# Altium schematic sheet Schematic.SchDoc (part 3 of 3)
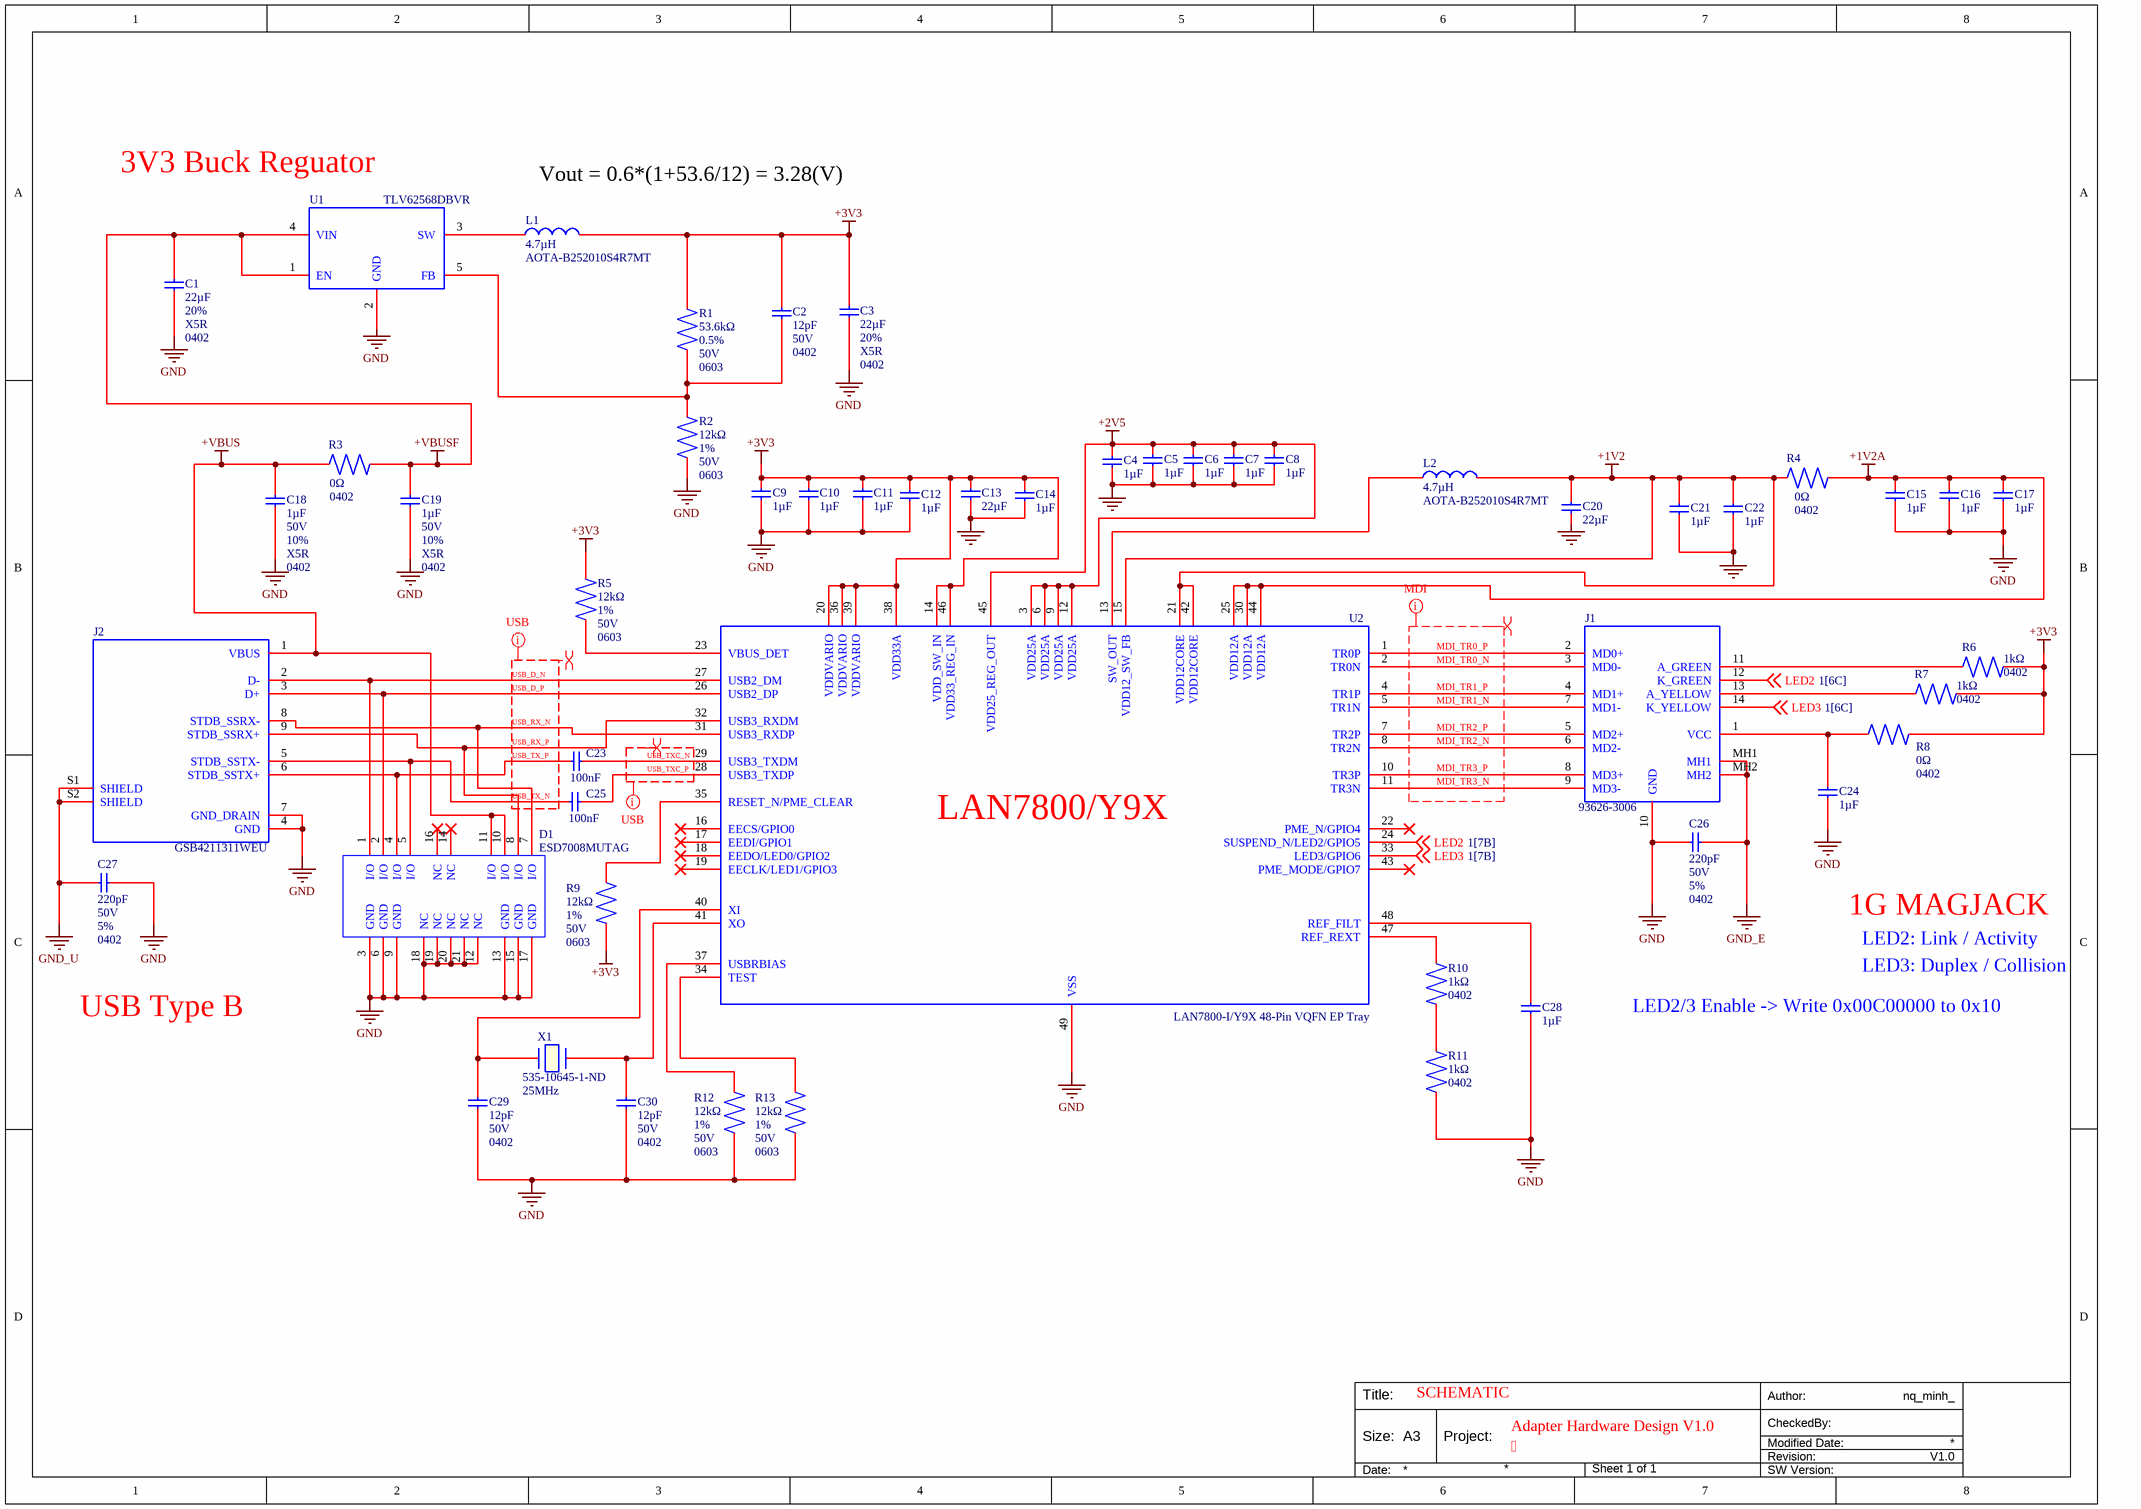
[diagram p2: Schematic.SchDoc]

## Library data of the parts (continued)
R3 R4 R8 = RC0402JR-070RL: GENERAL PURPOSE CHIP RESISTOR Metal Glaze/thick Film, 0.0625W, 0ohm, Surface Mount, 0402; Manufacturer: Yageo Group; Max Power Dissipation: 63mW; Power Rating: 62.5mW; Temperature Coefficient: 200ppm/°C; Voltage Rating (DC): 50V; Tolerance: 5%; Supplier: DigiKey; Supplier Part Number: 311-0.0JRDKR-ND; Manufacturer Part Number: RC0402JR-070RL; RoHS: Compliant; Category: Chip SMD Resistors; Stock: 16568824; Pricing: 1=0,1, 10=0,010, 25=0,0064, 50=0,0056, 100=0,0048, 250=0,00404, 500=0,00356, 1000=0,00313, 5000=0,00237 (USD); Case Code (Imperial): 0402; China RoHS: Non-Compliant; Composition: Thick Film; Contact Plating: Tin; Depth: 500µm; Features: Moisture Resistant; Height: 350µm; Lead Free: Lead Free; Length: 1mm; Lifecycle Status: Production; Max Operating Temperature: 155°C; Military Standard: Not; Min Operating Temperature: -55°C; Mounting Technology: Surface Mount; Pins: 2; Number of Terminals: 2; Number of Terminations: 2; Packaging: Tape & Reel; Radiation Hardening: No; REACH SVHC: Yes; Value: 0Ω; Schedule B: 8533290000, 8533290000|8533290000, 8533290000|8533290000|8533290000, 8533290000|8533290000|8533290000|8533290000; Termination: SMD/SMT; Width: 500µm; ComponentLink1URL: https://datasheet.octopart.com:443/RC0402JR-070RL-Yageo-datasheet-182189538.pdf?src-supplier=IHS; ComponentLink1Description: https://datasheet.octopart.com:443/RC0402JR-070RL-Yageo-datasheet-182189538.pdf?src-supplier=IHS; ComponentLink2URL: https://datasheet.octopart.com:443/RC0402JR-070RL-Yageo-datasheet-10408619.pdf?src-supplier=Newark; ComponentLink2Description: https://datasheet.octopart.com:443/RC0402JR-070RL-Yageo-datasheet-10408619.pdf?src-supplier=Newark; ComponentLink3URL: https://datasheet.octopart.com:443/RC0402JR-070RL-Yageo-Group-datasheet-181964826.pdf?src-supplier=Newark; ComponentLink3Description: https://datasheet.octopart.com:443/RC0402JR-070RL-Yageo-Group-datasheet-181964826.pdf?src-supplier=Newark; ComponentLink4URL: https://datasheet.octopart.com:443/RC0402JR-070RL-Yageo-Group-datasheet-190305687.pdf?src-supplier=Future+Electronics; ComponentLink4Description: https://datasheet.octopart.com:443/RC0402JR-070RL-Yageo-Group-datasheet-190305687.pdf?src-supplier=Future+Electronics; ComponentLink5URL: https://datasheet.octopart.com:443/RC0402JR-070RL-Yageo-datasheet-164759695.pdf?src-supplier=Future+Electronics; ComponentLink5Description: https://datasheet.octopart.com:443/RC0402JR-070RL-Yageo-datasheet-164759695.pdf?src-supplier=Future+Electronics; ComponentLink6URL: https://datasheet.octopart.com:443/RC0402JR-070RL-Yageo-datasheet-137700087.pdf?src-supplier=Future+Electronics; ComponentLink6Description: https://datasheet.octopart.com:443/RC0402JR-070RL-Yageo-datasheet-137700087.pdf?src-supplier=Future+Electronics; ComponentLink7URL: https://datasheet.octopart.com:443/RC0402JR-070RL-Yageo-datasheet-12531192.pdf?src-supplier=Seeed+Studio; ComponentLink7Description: https://datasheet.octopart.com:443/RC0402JR-070RL-Yageo-datasheet-12531192.pdf?src-supplier=Seeed+Studio; ComponentLink8URL: https://datasheet.octopart.com:443/RC0402JR-070RL-Yageo-datasheet-8324527.pdf?src-supplier=TME; ComponentLink8Description: https://datasheet.octopart.com:443/RC0402JR-070RL-Yageo-datasheet-8324527.pdf?src-supplier=TME; ComponentLink9URL: https://datasheet.octopart.com:443/RC0402JR-070RL-Yageo-datasheet-62067350.pdf?src-supplier=Farnell; ComponentLink9Description: https://datasheet.octopart.com:443/RC0402JR-070RL-Yageo-datasheet-62067350.pdf?src-supplier=Farnell; ComponentLink10URL: https://datasheet.octopart.com:443/RC0402JR-070RL-Yageo-datasheet-8329306.pdf?src-supplier=element14; ComponentLink10Description: https://datasheet.octopart.com:443/RC0402JR-070RL-Yageo-datasheet-8329306.pdf?src-supplier=element14; ComponentLink11URL: https://datasheet.octopart.com:443/RC0402JR-070RL-Yageo-datasheet-505231.pdf?src-supplier=element14; ComponentLink11Description: https://datasheet.octopart.com:443/RC0402JR-070RL-Yageo-datasheet-505231.pdf?src-supplier=element14; ComponentLink12URL: https://datasheet.octopart.com:443/RC0402JR-070RL-Yageo-datasheet-175423674.pdf?src-supplier=SOS+electronic; ComponentLink12Description: https://datasheet.octopart.com:443/RC0402JR-070RL-Yageo-datasheet-175423674.pdf?src-supplier=SOS+electronic; ComponentLink13URL: https://datasheet.octopart.com/RC0402JR-070RL-Yageo-datasheet-73766026.pdf; ComponentLink13Description: https://datasheet.octopart.com/RC0402JR-070RL-Yageo-datasheet-73766026.pdf; ComponentLink14URL: http://sigma.octopart.com:80/conflict_mineral_statement/Yageo-company-3.pdf?src-supplier=Compliance+Statements; ComponentLink14Description: http://sigma.octopart.com:80/conflict_mineral_statement/Yageo-company-3.pdf?src-supplier=Compliance+Statements; ComponentLink15URL: http://sigma.octopart.com:80/rohs_statement/Yageo-company-2.pdf?src-supplier=Compliance+Statements; ComponentLink15Description: http://sigma.octopart.com:80/rohs_statement/Yageo-company-2.pdf?src-supplier=Compliance+Statements; LCSC Part: C60485; Voltage Rating: 50V
R6 R7 R10 R11 = R0402_1kΩ_0.1%: RES SMD 1K OHM 0.1% 1/16W 0402 / 1 kOhms ±0.1% 0.063W, 1/16W Chip Resistor 0402 (1005 Metric) Thin Film; Manufacturer: Yageo Group; Manufacturer Part Number: RT0402BRD071KL; Max Power Dissipation: 63mW; Power Rating: 62.5mW; Temperature Coefficient: 25ppm/°C; Voltage Rating (DC): 50V; Supplier: DigiKey; Supplier Part Number: YAG1386CT-ND; RoHS: Compliant; Category: Chip SMD Resistors; Stock: 101139; Pricing: 1=0,1, 10=0,078, 25=0,0724, 50=0,0684, 100=0,0646, 250=0,05992, 500=0,05672, 1000=0,05377, 5000=0,04796 (USD); Case Code (Imperial): 0402; China RoHS: Non-Compliant; Composition: Thin Film; Depth: 500µm; Features: Moisture Resistant; Height: 300µm; Lead Free: Lead Free; Length: 1mm; Lifecycle Status: Production; Max Operating Temperature: 155°C; Military Standard: Not; Min Operating Temperature: -55°C; Mounting Technology: Surface Mount; Number of Terminals: 2; Number of Terminations: 2; REACH SVHC: Yes; Value: 1kΩ; Schedule B: 8533210045, 8533210045|8533210045|8533210045|8533210045|8533210045|8533210045|8533210045|8533210045|8533210045|8533210045|8533210045|8533210045|8533210045, 8533210045|8533210045|8533210045|8533210045|8533210045|8533210045|8533210045|8533210045|8533210045|8533210045|8533210045|8533210045|8533210045|8533210045, 8533210045|8533210045|8533210045|8533210045|8533210045|8533210045|8533210045|8533210045|8533210045|8533210045|8533210045|8533210045|8533210045|8533210045|8533210045; Termination: SMD/SMT; Weight: 652.039032µg; Width: 500µm; Working Voltage: 50V; ComponentLink1URL: https://datasheet.octopart.com:443/RT0402BRD071KL-Yageo-datasheet-176402239.pdf?src-supplier=Future+Electronics; ComponentLink1Description: https://datasheet.octopart.com:443/RT0402BRD071KL-Yageo-datasheet-176402239.pdf?src-supplier=Future+Electronics; ComponentLink2URL: https://datasheet.octopart.com:443/RT0402BRD071KL-Yageo-datasheet-169971040.pdf?src-supplier=Future+Electronics; ComponentLink2Description: https://datasheet.octopart.com:443/RT0402BRD071KL-Yageo-datasheet-169971040.pdf?src-supplier=Future+Electronics; ComponentLink3URL: https://datasheet.octopart.com:443/RT0402BRD071KL-Yageo-datasheet-166250672.pdf?src-supplier=Future+Electronics; ComponentLink3Description: https://datasheet.octopart.com:443/RT0402BRD071KL-Yageo-datasheet-166250672.pdf?src-supplier=Future+Electronics; ComponentLink4URL: https://datasheet.octopart.com:443/RT0402BRD071KL-Yageo-datasheet-136673517.pdf?src-supplier=Future+Electronics; ComponentLink4Description: https://datasheet.octopart.com:443/RT0402BRD071KL-Yageo-datasheet-136673517.pdf?src-supplier=Future+Electronics; ComponentLink5URL: https://datasheet.octopart.com:443/RT0402BRD071KL-Yageo-datasheet-137700930.pdf?src-supplier=Future+Electronics; ComponentLink5Description: https://datasheet.octopart.com:443/RT0402BRD071KL-Yageo-datasheet-137700930.pdf?src-supplier=Future+Electronics; ComponentLink6URL: https://datasheet.octopart.com:443/RT0402BRD071KL-Yageo-datasheet-96443642.pdf?src-supplier=Future+Electronics; ComponentLink6Description: https://datasheet.octopart.com:443/RT0402BRD071KL-Yageo-datasheet-96443642.pdf?src-supplier=Future+Electronics; ComponentLink7URL: https://datasheet.octopart.com:443/RT0402BRD071KL-Yageo-datasheet-12594463.pdf?src-supplier=Future+Electronics; ComponentLink7Description: https://datasheet.octopart.com:443/RT0402BRD071KL-Yageo-datasheet-12594463.pdf?src-supplier=Future+Electronics; ComponentLink8URL: https://datasheet.octopart.com:443/RT0402BRD071KL-Yageo-datasheet-8324589.pdf?src-supplier=Future+Electronics; ComponentLink8Description: https://datasheet.octopart.com:443/RT0402BRD071KL-Yageo-datasheet-8324589.pdf?src-supplier=Future+Electronics; ComponentLink9URL: https://datasheet.octopart.com:443/RT0402BRD071KL-Yageo-datasheet-34924148.pdf?src-supplier=Future+Electronics; ComponentLink9Description: https://datasheet.octopart.com:443/RT0402BRD071KL-Yageo-datasheet-34924148.pdf?src-supplier=Future+Electronics; ComponentLink10URL: https://datasheet.octopart.com:443/RT0402BRD071KL-Yageo-datasheet-141265893.pdf?src-supplier=ODG+(Origin+Data+Global); ComponentLink10Description: https://datasheet.octopart.com:443/RT0402BRD071KL-Yageo-datasheet-141265893.pdf?src-supplier=ODG+(Origin+Data+Global); ComponentLink11URL: https://sigma.octopart.com:443/138820526/technical_drawing/Yageo-RT0402BRD071KL.pdf?src-supplier=Upverter; ComponentLink11Description: https://sigma.octopart.com:443/138820526/technical_drawing/Yageo-RT0402BRD071KL.pdf?src-supplier=Upverter; ComponentLink12URL: https://datasheet.octopart.com:443/RT0402BRD071KL-Yageo-datasheet-10915759.pdf?src-supplier=TME; ComponentLink12Description: https://datasheet.octopart.com:443/RT0402BRD071KL-Yageo-datasheet-10915759.pdf?src-supplier=TME; ComponentLink13URL: https://datasheet.octopart.com:443/RT0402BRD071KL-Yageo-datasheet-164439670.pdf?src-supplier=Newark; ComponentLink13Description: https://datasheet.octopart.com:443/RT0402BRD071KL-Yageo-datasheet-164439670.pdf?src-supplier=Newark; ComponentLink14URL: https://datasheet.octopart.com:443/RT0402BRD071KL-Yageo-datasheet-120102479.pdf?src-supplier=Megastar; ComponentLink14Description: https://datasheet.octopart.com:443/RT0402BRD071KL-Yageo-datasheet-120102479.pdf?src-supplier=Megastar; ComponentLink15URL: https://datasheet.octopart.com/RT0402BRD071KL-Yageo-datasheet-86813807.pdf; ComponentLink15Description: https://datasheet.octopart.com/RT0402BRD071KL-Yageo-datasheet-86813807.pdf; ComponentLink16URL: http://sigma.octopart.com:80/conflict_mineral_statement/Yageo-company-3.pdf?src-supplier=Compliance+Statements; ComponentLink16Description: http://sigma.octopart.com:80/conflict_mineral_statement/Yageo-company-3.pdf?src-supplier=Compliance+Statements; ComponentLink17URL: http://sigma.octopart.com:80/rohs_statement/Yageo-company-2.pdf?src-supplier=Compliance+Statements; ComponentLink17Description: http://sigma.octopart.com:80/rohs_statement/Yageo-company-2.pdf?src-supplier=Compliance+Statements; LCSC Part: C852624; Tolerance: 0.1%; Voltage Rating: 50V
U1 = TLV62568DBVR: ROHS3Compliant Adjustable Positive DUAL Switching Regulator IC -40C~125C TJ 1.5MHz 1A 1.6mm; Manufacturer: Texas Instruments; Manufacturer Lifecycle Status: ACTIVE; Max Duty Cycle: 100%; Max Junction Temperature (Tj): 125°C; Max Supply Voltage: 5.5V; Min Supply Voltage: 2.5V; Nominal Supply Current: 35µA; Number of Channels: 1; Topology: Buck; Supplier: DigiKey; Supplier Part Number: 296-47359-1-ND; Manufacturer Part Number: TLV62568DBVR; RoHS: Compliant; Category: Voltage Regulators - Switching; Stock: 47066; Pricing: 1=0,32, 10=0,222, 25=0,1972, 100=0,1697, 250=0,1566, 500=0,14868, 1000=0,14216 (USD); Case/Package: SOT-23; Height: 1.45mm; Length: 2.9mm; Lifecycle Status: Production; Max Operating Temperature: 125°C; Min Operating Temperature: -40°C; Number of Outputs: 1; Pins: 5; Output Current: 1A; Output Voltage: 5.5V; Packaging: Cut Tape; Schedule B: 8542390000, 8542390000|8542390000|8542390000|8542390000|8542390000; Switching Frequency: 1.5MHz; Thickness: 1.2mm; Width: 1.6mm; ComponentLink1URL: https://sigma.octopart.com:443/177332311/technical_drawing/Texas-Instruments-TLV62568DBVR.pdf?src-supplier=Texas+Instruments; ComponentLink1Description: https://sigma.octopart.com:443/177332311/technical_drawing/Texas-Instruments-TLV62568DBVR.pdf?src-supplier=Texas+Instruments; ComponentLink2URL: https://octopart.com:443/opatz8j6/c1?t=vPHbBTZync03nc36PRH4evl9f9XS3pRQdSmbiysQsMfDLG0HXrdI_A5Kjl8OaFtSQD0YLbQeJgMP-_JQaVrb-4MwD9lWSaxscQNQWteh7Ox_BwG2tlOEVzeoiAwU9PQpDczjkd1NvrO29_tBD_-kASWfwXWMSSZbSn8J3ugEkJYM36bt8V1c5ce8ivLbuwT9JHlDmiS_2qQgvZdWgloT7CjqD7HxfNGaoxnW2-1KbVj-rghSNpHCP-x5DM5iAr4G7eP6joer0wBZ-Um1XcgZjkJuH9ew8i6R7p-JMymC5vPEZUbQvtDFT-Y1ZDIuA0Iyj9w-1LHecovXeRxQwQ6BdQFRy4KrXcWI-2UEDx3VIn_4HQ_sDR11ymwJEK4-_c0cmN6tyAYi&src-supplier=Texas+Instruments; ComponentLink2Description: https://octopart.com:443/opatz8j6/c1?t=vPHbBTZync03nc36PRH4evl9f9XS3pRQdSmbiysQsMfDLG0HXrdI_A5Kjl8OaFtSQD0YLbQeJgMP-_JQaVrb-4MwD9lWSaxscQNQWteh7Ox_BwG2tlOEVzeoiAwU9PQpDczjkd1NvrO29_tBD_-kASWfwXWMSSZbSn8J3ugEkJYM36bt8V1c5ce8ivLbuwT9JHlDmiS_2qQgvZdWgloT7CjqD7HxfNGaoxnW2-1KbVj-rghSNpHCP-x5DM5iAr4G7eP6joer0wBZ-Um1XcgZjkJuH9ew8i6R7p-JMymC5vPEZUbQvtDFT-Y1ZDIuA0Iyj9w-1LHecovXeRxQwQ6BdQFRy4KrXcWI-2UEDx3VIn_4HQ_sDR11ymwJEK4-_c0cmN6tyAYi&src-supplier=Texas+Instruments; ComponentLink3URL: https://sigma.octopart.com:443/175570406/technical_drawing/Texas-Instruments-TLV62568DBVR.pdf?src-supplier=Texas+Instruments; ComponentLink3Description: https://sigma.octopart.com:443/175570406/technical_drawing/Texas-Instruments-TLV62568DBVR.pdf?src-supplier=Texas+Instruments; ComponentLink4URL: https://sigma.octopart.com:443/169406034/technical_drawing/Texas-Instruments-TLV62568DBVR.pdf?src-supplier=Texas+Instruments; ComponentLink4Description: https://sigma.octopart.com:443/169406034/technical_drawing/Texas-Instruments-TLV62568DBVR.pdf?src-supplier=Texas+Instruments; ComponentLink5URL: https://sigma.octopart.com:443/155939316/technical_drawing/Texas-Instruments-TLV62568DBVR.pdf?src-supplier=Texas+Instruments; ComponentLink5Description: https://sigma.octopart.com:443/155939316/technical_drawing/Texas-Instruments-TLV62568DBVR.pdf?src-supplier=Texas+Instruments; ComponentLink6URL: https://sigma.octopart.com:443/102331370/technical_drawing/Texas-Instruments-TLV62568DBVR.pdf?src-supplier=Texas+Instruments; ComponentLink6Description: https://sigma.octopart.com:443/102331370/technical_drawing/Texas-Instruments-TLV62568DBVR.pdf?src-supplier=Texas+Instruments; ComponentLink7URL: https://sigma.octopart.com:443/49249325/technical_drawing/Texas-Instruments-TLV62568DBVR.pdf?src-supplier=Texas+Instruments; ComponentLink7Description: https://sigma.octopart.com:443/49249325/technical_drawing/Texas-Instruments-TLV62568DBVR.pdf?src-supplier=Texas+Instruments; ComponentLink8URL: https://datasheet.octopart.com:443/TLV62568DBVR-Texas-Instruments-datasheet-82523182.pdf?src-supplier=Newark; ComponentLink8Description: https://datasheet.octopart.com:443/TLV62568DBVR-Texas-Instruments-datasheet-82523182.pdf?src-supplier=Newark; ComponentLink9URL: https://datasheet.octopart.com:443/TLV62568DBVR-Texas-Instruments-datasheet-137316104.pdf?src-supplier=Future+Electronics; ComponentLink9Description: https://datasheet.octopart.com:443/TLV62568DBVR-Texas-Instruments-datasheet-137316104.pdf?src-supplier=Future+Electronics; ComponentLink10URL: http://sigma.octopart.com:80/reach_statement/Texas-Instruments-company-64.pdf?src-supplier=Compliance+Statements; ComponentLink10Description: http://sigma.octopart.com:80/reach_statement/Texas-Instruments-company-64.pdf?src-supplier=Compliance+Statements; ComponentLink11URL: http://sigma.octopart.com:80/conflict_mineral_statement/Texas-Instruments-company-63.pdf?src-supplier=Compliance+Statements; ComponentLink11Description: http://sigma.octopart.com:80/conflict_mineral_statement/Texas-Instruments-company-63.pdf?src-supplier=Compliance+Statements; LCSC Part: C163219
U2 = LAN7800-I/Y9X: Ethernet CTLR Single Chip 10Mbps/100Mbps/1000Mbps 1.8V/3.3V Automotive 48-Pin VQFN EP Tray; Manufacturer: Microchip; Manufacturer Lifecycle Status: REL; Interface: Ethernet, USB; Max Supply Voltage: 3.63V; Min Supply Voltage: 1.62V; Supplier: DigiKey; Supplier Part Number: LAN7800-I/Y9X-ND; Manufacturer Part Number: LAN7800-I/Y9X; RoHS: Compliant; Category: Ethernet Controller; Stock: 4393; Pricing: 1=10,87, 25=9,04, 100=8,7375 (USD); Projected EOL Date: 2044-10-28; Ambient Temperature Range High: 85°C; Case/Package: VQFN; Country of Assembly: Taiwan, Thailand; Country of Fabrication: Taiwan; Country of Origin: Taiwan, Thailand; Export Control Classification Number (ECCN) Code: EAR99; Height: 1mm; HS Code: 8542.39.0090; Harmonized Tariff Schedule (HTS) Code: 8542.39.0060; Introduction Date: 2016-10-28; Lifecycle Status: Production; Max Operating Temperature: 85°C; Min Operating Temperature: -40°C; Pins: 48; ComponentLink1URL: https://datasheet.octopart.com:443/LAN7800-I-Y9X-Microchip-datasheet-145017544.pdf?src-supplier=Augswan; ComponentLink1Description: https://datasheet.octopart.com:443/LAN7800-I-Y9X-Microchip-datasheet-145017544.pdf?src-supplier=Augswan; ComponentLink2URL: https://datasheet.octopart.com:443/LAN7800-I-Y9X-Microchip-datasheet-184559086.pdf?src-supplier=Microchip; ComponentLink2Description: https://datasheet.octopart.com:443/LAN7800-I-Y9X-Microchip-datasheet-184559086.pdf?src-supplier=Microchip; ComponentLink3URL: https://datasheet.octopart.com:443/LAN7800-I-Y9X-Microchip-datasheet-175858607.pdf?src-supplier=Microchip; ComponentLink3Description: https://datasheet.octopart.com:443/LAN7800-I-Y9X-Microchip-datasheet-175858607.pdf?src-supplier=Microchip; ComponentLink4URL: https://datasheet.octopart.com:443/LAN7800-I-Y9X-Microchip-datasheet-102166462.pdf?src-supplier=Newark; ComponentLink4Description: https://datasheet.octopart.com:443/LAN7800-I-Y9X-Microchip-datasheet-102166462.pdf?src-supplier=Newark; ComponentLink5URL: https://datasheet.octopart.com:443/LAN7800-I-Y9X-Microchip-datasheet-78799795.pdf?src-supplier=TME; ComponentLink5Description: https://datasheet.octopart.com:443/LAN7800-I-Y9X-Microchip-datasheet-78799795.pdf?src-supplier=TME; ComponentLink6URL: http://sigma.octopart.com:80/188454375/materials_sheet/Microchip-LAN7800-I-Y9X.pdf?src-supplier=Compliance+Statements; ComponentLink6Description: http://sigma.octopart.com:80/188454375/materials_sheet/Microchip-LAN7800-I-Y9X.pdf?src-supplier=Compliance+Statements; ComponentLink7URL: http://sigma.octopart.com:80/rohs_statement/Microchip-company-71.pdf?src-supplier=Compliance+Statements; ComponentLink7Description: http://sigma.octopart.com:80/rohs_statement/Microchip-company-71.pdf?src-supplier=Compliance+Statements; ComponentLink8URL: http://sigma.octopart.com:80/reach_statement/Microchip-company-70.pdf?src-supplier=Compliance+Statements; ComponentLink8Description: http://sigma.octopart.com:80/reach_statement/Microchip-company-70.pdf?src-supplier=Compliance+Statements; ComponentLink9URL: http://sigma.octopart.com:80/conflict_mineral_statement/Microchip-company-69.pdf?src-supplier=Compliance+Statements; ComponentLink9Description: http://sigma.octopart.com:80/conflict_mineral_statement/Microchip-company-69.pdf?src-supplier=Compliance+Statements; ComponentLink10URL: http://sigma.octopart.com:80/conflict_mineral_statement/Microchip-company-68.pdf?src-supplier=Compliance+Statements; ComponentLink10Description: http://sigma.octopart.com:80/conflict_mineral_statement/Microchip-company-68.pdf?src-supplier=Compliance+Statements; LCSC Part: C633489
X1 = ABM3-25.000MHZ-D2Y-T: Crystal 25MHz ±20ppm (Tol) ±30ppm (Stability) 18pF FUND 30Ohm 2-Pin Mini-CSMD T/R; Manufacturer: Abracon; ESR (Equivalent Series Resistance): 30Ω; Frequency Tolerance: 0.002%; ESR: 50Ω; Supplier: DigiKey; Manufacturer Part Number: ABM3-25.000MHZ-D2Y-T; RoHS: Compliant; Category: Crystals; Stock: 14698; Pricing: 1=0,55, 10=0,481, 25=0,4552, 50=0,4364, 100=0,4183, 250=0,39556, 500=0,37918 (USD); Case/Package: CSMD; China RoHS: Non-Compliant; Composition: Ceramic; Depth: 3.2mm; Frequency Stability: 30ppm; Height: 1.3mm; Lead Free: Lead Free; Length: 5mm; Lifecycle Status: Production; Load Capacitance: 18pF; Max Operating Temperature: 85°C; Min Operating Temperature: -40°C; Mounting Technology: Surface Mount; Pins: 2; Packaging: Cut Tape; REACH SVHC: Yes; Schedule B: 8541600060, 8541600060|8541600060|8541600060|8541600060|8541600060; Termination: SMD/SMT; Tolerance: 0.002%; Width: 3.2mm; ComponentLink1URL: https://datasheet.octopart.com:443/ABM3-25.000MHZ-D2Y-T-Abracon-datasheet-182205007.pdf?src-supplier=JRH+Electronics; ComponentLink1Description: https://datasheet.octopart.com:443/ABM3-25.000MHZ-D2Y-T-Abracon-datasheet-182205007.pdf?src-supplier=JRH+Electronics; ComponentLink2URL: https://datasheet.octopart.com:443/ABM3-25.000MHZ-D2Y-T-Abracon-datasheet-32780515.pdf?src-supplier=element14+APAC; ComponentLink2Description: https://datasheet.octopart.com:443/ABM3-25.000MHZ-D2Y-T-Abracon-datasheet-32780515.pdf?src-supplier=element14+APAC; ComponentLink3URL: https://sigma.octopart.com:443/138895675/technical_drawing/Abracon-ABM3-25.000MHZ-D2Y-T.pdf?src-supplier=Upverter; ComponentLink3Description: https://sigma.octopart.com:443/138895675/technical_drawing/Abracon-ABM3-25.000MHZ-D2Y-T.pdf?src-supplier=Upverter; ComponentLink4URL: https://datasheet.octopart.com:443/ABM3-25.000MHZ-D2Y-T-Abracon-datasheet-13417521.pdf?src-supplier=Sager+Electronics; ComponentLink4Description: https://datasheet.octopart.com:443/ABM3-25.000MHZ-D2Y-T-Abracon-datasheet-13417521.pdf?src-supplier=Sager+Electronics; ComponentLink5URL: https://datasheet.octopart.com:443/ABM3-25.000MHZ-D2Y-T-Abracon-datasheet-8862594.pdf?src-supplier=Sager+Electronics; ComponentLink5Description: https://datasheet.octopart.com:443/ABM3-25.000MHZ-D2Y-T-Abracon-datasheet-8862594.pdf?src-supplier=Sager+Electronics; ComponentLink6URL: https://datasheet.octopart.com:443/ABM3-25.000MHZ-D2Y-T-Abracon-datasheet-8853172.pdf?src-supplier=Sager+Electronics; ComponentLink6Description: https://datasheet.octopart.com:443/ABM3-25.000MHZ-D2Y-T-Abracon-datasheet-8853172.pdf?src-supplier=Sager+Electronics; ComponentLink7URL: https://datasheet.octopart.com:443/ABM3-25.000MHZ-D2Y-T-Abracon-datasheet-8835795.pdf?src-supplier=Sager+Electronics; ComponentLink7Description: https://datasheet.octopart.com:443/ABM3-25.000MHZ-D2Y-T-Abracon-datasheet-8835795.pdf?src-supplier=Sager+Electronics; ComponentLink8URL: https://datasheet.octopart.com:443/ABM3-25.000MHZ-D2Y-T-Abracon-datasheet-8815637.pdf?src-supplier=Sager+Electronics; ComponentLink8Description: https://datasheet.octopart.com:443/ABM3-25.000MHZ-D2Y-T-Abracon-datasheet-8815637.pdf?src-supplier=Sager+Electronics; ComponentLink9URL: https://datasheet.octopart.com:443/ABM3-25.000MHZ-D2Y-T-Abracon-datasheet-8808528.pdf?src-supplier=Sager+Electronics; ComponentLink9Description: https://datasheet.octopart.com:443/ABM3-25.000MHZ-D2Y-T-Abracon-datasheet-8808528.pdf?src-supplier=Sager+Electronics; ComponentLink10URL: https://datasheet.octopart.com:443/ABM3-25.000MHZ-D2Y-T-Abracon-datasheet-8488864.pdf?src-supplier=Sager+Electronics; ComponentLink10Description: https://datasheet.octopart.com:443/ABM3-25.000MHZ-D2Y-T-Abracon-datasheet-8488864.pdf?src-supplier=Sager+Electronics; ComponentLink11URL: https://datasheet.octopart.com:443/ABM3-25.000MHZ-D2Y-T-Abracon-datasheet-8324950.pdf?src-supplier=Sager+Electronics; ComponentLink11Description: https://datasheet.octopart.com:443/ABM3-25.000MHZ-D2Y-T-Abracon-datasheet-8324950.pdf?src-supplier=Sager+Electronics; ComponentLink12URL: https://datasheet.octopart.com:443/ABM3-25.000MHZ-D2Y-T-Abracon-datasheet-577709.pdf?src-supplier=Sager+Electronics; ComponentLink12Description: https://datasheet.octopart.com:443/ABM3-25.000MHZ-D2Y-T-Abracon-datasheet-577709.pdf?src-supplier=Sager+Electronics; ComponentLink13URL: https://datasheet.octopart.com:443/ABM3-25.000MHZ-D2Y-T-Abracon-datasheet-154724144.pdf?src-supplier=Sager+Electronics; ComponentLink13Description: https://datasheet.octopart.com:443/ABM3-25.000MHZ-D2Y-T-Abracon-datasheet-154724144.pdf?src-supplier=Sager+Electronics; ComponentLink14URL: https://datasheet.octopart.com:443/ABM3-25.000MHZ-D2Y-T-Abracon-datasheet-128558652.pdf?src-supplier=X-ON; ComponentLink14Description: https://datasheet.octopart.com:443/ABM3-25.000MHZ-D2Y-T-Abracon-datasheet-128558652.pdf?src-supplier=X-ON; ComponentLink15URL: https://datasheet.octopart.com:443/ABM3-25.000MHZ-D2Y-T-Abracon-datasheet-12514944.pdf?src-supplier=Farnell; ComponentLink15Description: https://datasheet.octopart.com:443/ABM3-25.000MHZ-D2Y-T-Abracon-datasheet-12514944.pdf?src-supplier=Farnell; ComponentLink16URL: http://sigma.octopart.com:80/conflict_mineral_statement/Abracon-company-27.pdf?src-supplier=Compliance+Statements; ComponentLink16Description: http://sigma.octopart.com:80/conflict_mineral_statement/Abracon-company-27.pdf?src-supplier=Compliance+Statements; LCSC Part: C148312